# EAGLE schematic fpv-diversity (EAGLE 9.6.2)
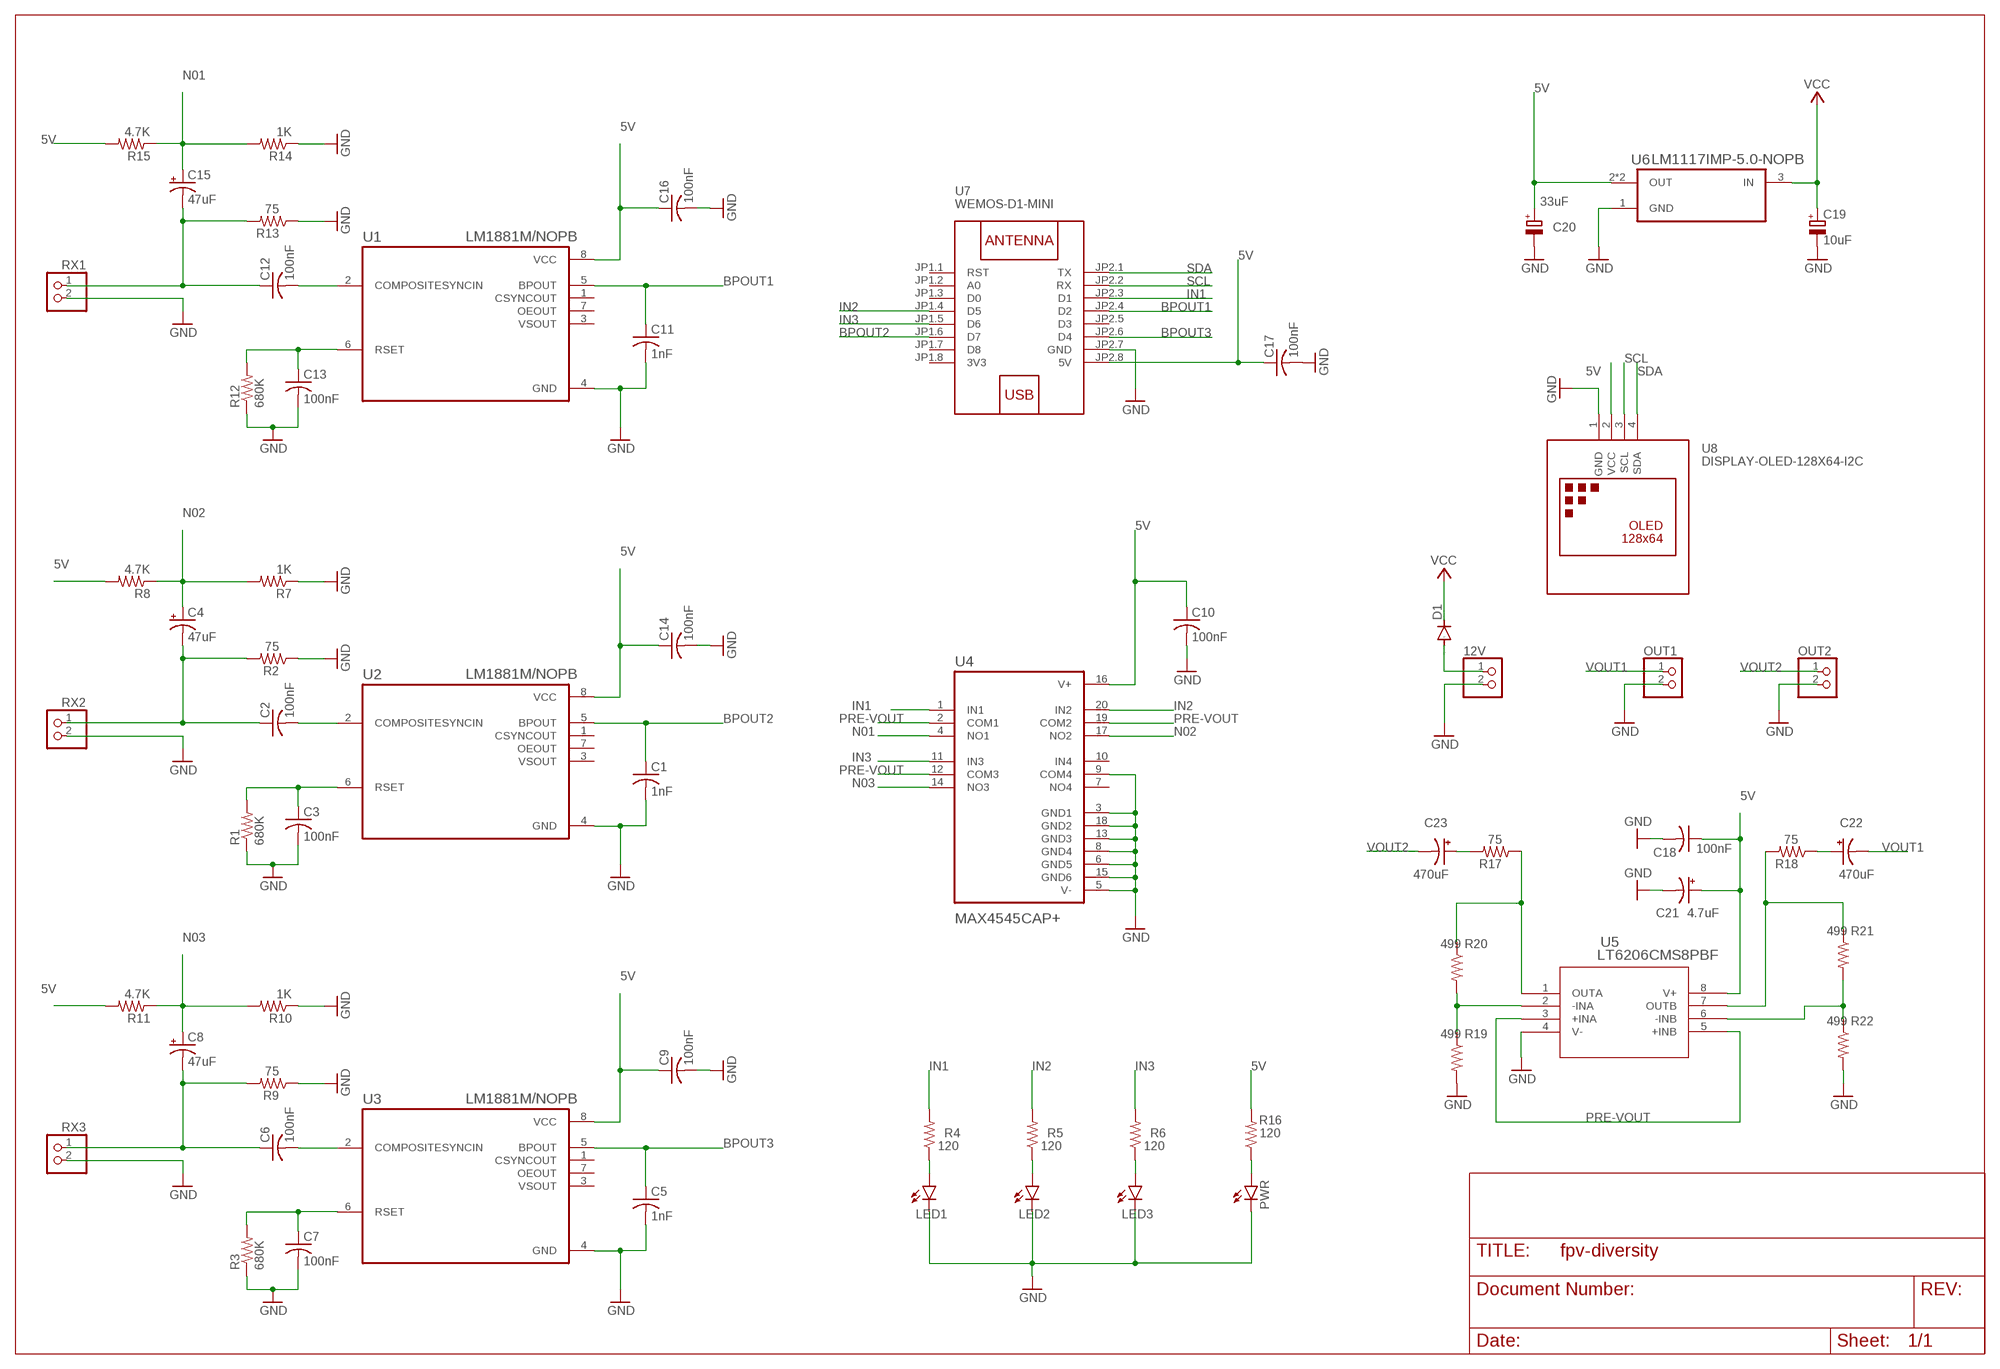
[diagram p0: schematic, sheet 1]

## Parts
12V  PINHD-1X2  [1X02]
C1  1nF  C-USC0603  [C0603]
C2  100nF  C-USC0805  [C0805]
C3  100nF  C-USC0805  [C0805]
C4  47uF  CPOL-USCT3216  [CT3216]
C5  1nF  C-USC0603  [C0603]
C6  100nF  C-USC0805  [C0805]
C7  100nF  C-USC0805  [C0805]
C8  47uF  CPOL-USCT3216  [CT3216]
C9  100nF  C-USC0805  [C0805]
C10  100nF  C-USC0805  [C0805]
C11  1nF  C-USC0603  [C0603]
C12  100nF  C-USC0805  [C0805]
C13  100nF  C-USC0805  [C0805]
C14  100nF  C-USC0805  [C0805]
C15  47uF  CPOL-USCT3216  [CT3216]
C16  100nF  C-USC0805  [C0805]
C17  100nF  C-USC0805  [C0805]
C18  100nF  C-USC0805  [C0805]
C19  10uF  CPOL-EUD/7343-31W  [D/7343-31W]
C20  33uF  CPOL-EUD/7343-31W  [D/7343-31W]
C21  4.7uF  CPOL-USCT3528  [CT3528]
C22  470uF  CPOL-USUD-6,3X7,7  [UD-6,3X7,7_NICHICON]
C23  470uF  CPOL-USUD-6,3X7,7  [UD-6,3X7,7_NICHICON]
D1  DIODE-DO-214AC  [DO-214AC]
LED1  LEDCHIPLED_0603  [CHIPLED_0603]
LED2  LEDCHIPLED_0603  [CHIPLED_0603]
LED3  LEDCHIPLED_0603  [CHIPLED_0603]
OUT1  PINHD-1X2  [1X02]
OUT2  PINHD-1X2  [1X02]
PWR  LEDCHIPLED_0603  [CHIPLED_0603]
R1  680K  R-US_R0805  [R0805]
R2  75  R-US_R0805  [R0805]
R3  680K  R-US_R0805  [R0805]
R4  120  R-US_R0603  [R0603]
R5  120  R-US_R0603  [R0603]
R6  120  R-US_R0603  [R0603]
R7  1K  R-US_R0805  [R0805]
R8  4.7K  R-US_R0805  [R0805]
R9  75  R-US_R0805  [R0805]
R10  1K  R-US_R0805  [R0805]
R11  4.7K  R-US_R0805  [R0805]
R12  680K  R-US_R0805  [R0805]
R13  75  R-US_R0805  [R0805]
R14  1K  R-US_R0805  [R0805]
R15  4.7K  R-US_R0805  [R0805]
R16  120  R-US_R0603  [R0603]
R17  75  R-US_R0805  [R0805]
R18  75  R-US_R0805  [R0805]
R19  499  R-US_R1206  [R1206]
R20  499  R-US_R1206  [R1206]
R21  499  R-US_R1206  [R1206]
R22  499  R-US_R1206  [R1206]
RX1  PINHD-1X2  [1X02]
RX2  PINHD-1X2  [1X02]
RX3  PINHD-1X2  [1X02]
U1  LM1881M/NOPB  [SOIC127P599X175-8N]
U2  LM1881M/NOPB  [SOIC127P599X175-8N]
U3  LM1881M/NOPB  [SOIC127P599X175-8N]
U4  MAX4545CAP+  [SOP65P777X199-20N]
U5  LT6206CMS8PBF  [MSOP-8_MS]
U6  LM1117IMP-5.0-NOPB  [SOT230P700X180-4N]
U7  WEMOS-D1-MINI  [WEMOS-D1-MINI]
U8  DISPLAY-OLED-128X64-I2C  [DISPLAY-OLED-128X64-I2C]

## Nets
5V: C9.1 C10.1 C14.1 C16.1 C17.1 C18.1 C20.+ C21.+ R8.2 R11.2 R15.2 R16.2 U1.8(VCC) U2.8(VCC) U3.8(VCC) U4.16(V+) U5.8(V+) U6.2(OUT) U6.4(OUT) U7.JP2.8(5V) U8.2(VCC)
BPOUT1: C11.1 U1.5(BPOUT) U7.JP2.4(D2)
BPOUT2: C1.1 U2.5(BPOUT) U7.JP1.6(D7)
BPOUT3: C5.1 U3.5(BPOUT) U7.JP2.6(D4)
GND: 12V.2 C1.2 C3.2 C5.2 C7.2 C9.2 C10.2 C11.2 C13.2 C14.2 C16.2 C17.2 C18.2 C19.- C20.- C21.- LED1.C LED2.C LED3.C OUT1.2 OUT2.2 PWR.C R1.1 R2.1 R3.1 R7.1 R9.1 R10.1 R12.1 R13.1 R14.1 R19.2 R22.2 RX1.2 RX2.2 RX3.2 U1.4(GND) U2.4(GND) U3.4(GND) U4.3(GND1) U4.5(V-) U4.6(GND5) U4.8(GND4) U4.9(COM4) U4.13(GND3) U4.15(GND6) U4.18(GND2) U5.4(V-) U6.1(GND) U7.JP2.7(GND) U8.1(GND)
IN1: R4.2 U4.1(IN1) U7.JP2.3(D1)
IN2: R5.2 U4.20(IN2) U7.JP1.4(D5)
IN3: R6.2 U4.11(IN3) U7.JP1.5(D6)
N01: C15.+ R14.2 R15.1 U4.4(NO1)
N02: C4.+ R7.2 R8.1 U4.17(NO2)
N03: C8.+ R10.2 R11.1 U4.14(NO3)
N$1: C7.1 R3.2 U3.6(RSET)
N$2: C3.1 R1.2 U2.6(RSET)
N$3: C2.2 U2.2(COMPOSITESYNCIN)
N$4: PWR.A R16.1
N$5: C6.2 U3.2(COMPOSITESYNCIN)
N$6: 12V.1 D1.A
N$7: LED1.A R4.1
N$8: LED2.A R5.1
N$9: LED3.A R6.1
N$10: C13.1 R12.2 U1.6(RSET)
N$11: C12.2 U1.2(COMPOSITESYNCIN)
N$12: R19.1 R20.2 U5.2(-INA)
N$13: R18.2 R21.1 U5.7(OUTB)
N$14: R21.2 R22.1 U5.6(-INB)
N$15: R17.1 R20.1 U5.1(OUTA)
N$16: C22.+ R18.1
N$17: C23.+ R17.2
PRE-VOUT: U4.2(COM1) U4.12(COM3) U4.19(COM2) U5.3(+INA) U5.5(+INB)
SCL: U7.JP2.2(RX) U8.3(SCL)
SDA: U7.JP2.1(TX) U8.4(SDA)
VCC: C19.+ D1.C U6.3(IN)
VID1: C12.1 C15.- R13.2 RX1.1
VID2: C2.1 C4.- R2.2 RX2.1
VID3: C6.1 C8.- R9.2 RX3.1
VOUT1: C22.- OUT1.1
VOUT2: C23.- OUT2.1
Unconnected: U1.1(CSYNCOUT) U1.3(VSOUT) U1.7(OEOUT) U2.1(CSYNCOUT) U2.3(VSOUT) U2.7(OEOUT) U3.1(CSYNCOUT) U3.3(VSOUT) U3.7(OEOUT) U4.7(NO4) U4.10(IN4) U7.JP1.1(RST) U7.JP1.2(A0) U7.JP1.3(D0) U7.JP1.7(D8) U7.JP2.5(D3)

## Power pins joined to a net without a drawn wire
3V3: U7.JP1.8(3V3)

## Library data of the parts
12V OUT1 OUT2 RX1-RX3 = pinhead:PINHD-1X2: PIN HEADER
C1-C3 C5-C7 C9-C14 C16-C18 = rcl:C-US: CAPACITOR, American symbol; SPICEPREFIX: C
C4 C8 C15 C21-C23 = rcl:CPOL-US: POLARIZED CAPACITOR, American symbol; SPICEPREFIX: C
C19 C20 = rcl:CPOL-EU: POLARIZED CAPACITOR, European symbol; SPICEPREFIX: C
D1 = diode:DIODE-: DIODE
LED1-LED3 PWR = led:LED: LED OSRAM: - CHIPLED LG R971, LG N971, LY N971, LG Q971, LY Q971, LO R971, LY R971 LH N974, LH R974 LS Q976, LO Q976, LY Q976 LO Q996 - Hyper CHIPLED LW Q18S LB Q993, LB Q99A, LB R99A - SideLED LS A670, LO A670, LY A670, LG A670, LP A670 LB A673, LV A673, LT A673, LW A673 LH A674 LY A675 LS A676, LA A676, LO A676, LY A676, LW A676 LS A679, LY A679, LG A679 - Hyper Micro SIDELED® LS Y876, LA Y876, LO Y876, LY Y876 LT Y87S - SmartLED LW L88C, LW L88S LB L89C, LB L89S, LG L890 LS L89K, LO L89K, LY L89K LS L896, LA L896, LO L896, LY L896 - TOPLED LS T670, LO T670, LY T670, LG T670, LP T670 LSG T670, LSP T670, LSY T670, LOP T670, LYG T670 LG T671, LOG T671, LSG T671 LB T673, LV T673, LT T673, LW T673 LH T674 LS T676, LA T676, LO T676, LY T676, LB T676, LH T676, LSB T676, LW T676 LB T67C, LV T67C, LT T67C, LS T67K, LO T67K, LY T67K, LW E67C LS E67B, LA E67B, LO E67B, LY E67B, LB E67C, LV E67C, LT E67C LW T67C LS T679, LY T679, LG T679 LS T770, LO T770, LY T770, LG T770, LP T770 LB T773, LV T773, LT T773, LW T773 LH T774 LS E675, LA E675, LY E675, LS T675 LS T776, LA T776, LO T776, LY T776, LB T776 LHGB T686 LT T68C, LB T68C - Hyper Mini TOPLED® LB M676 - Mini TOPLED Santana® LG M470 LS M47K, LO M47K, LY M47K Source: http://www.osram.convergy.de LUXEON: - LUMILED® LXK2-PW12-R00, LXK2-PW12-S00, LXK2-PW14-U00, LXK2-PW14-V00 LXK2-PM12-R00, LXK2-PM12-S00, LXK2-PM14-U00 LXK2-PE12-Q00, LXK2-PE12-R00, LXK2-PE12-S00, LXK2-PE14-T00, LXK2-PE14-U00 LXK2-PB12-K00, LXK2-PB12-L00, LXK2-PB12-M00, LXK2-PB14-N00, LXK2-PB14-P00, LXK2-PB14-Q00 LXK2-PR12-L00, LXK2-PR12-M00, LXK2-PR14-Q00, LXK2-PR14-R00 LXK2-PD12-Q00, LXK2-PD12-R00, LXK2-PD12-S00 LXK2-PH12-R00, LXK2-PH12-S00 LXK2-PL12-P00, LXK2-PL12-Q00, LXK2-PL12-R00 Source: www.luxeon.com KINGBRIGHT: KA-3528ASYC Source: www.kingbright.com
R1-R22 = rcl:R-US_: RESISTOR, American symbol; SPICEPREFIX: R
U1-U3 = LM1881M_NOPB:LM1881M/NOPB: Check prices <https://pricing.snapeda.com/parts/LM1881M/NOPB/Texas%20Instruments/view-part?ref=eda>; AVAILABILITY: Warning; DESCRIPTION: Video Sync Separator 8-SOIC 0 to 70; MF: Texas Instruments; MP: LM1881M/NOPB; PACKAGE: SOIC-8 Texas Instruments; PRICE: None; PURCHASE-URL: https://pricing.snapeda.com/search/part/LM1881M/NOPB/?ref=eda
U4 = MAX4545CAP_:MAX4545CAP+: None Check prices <https://pricing.snapeda.com/parts/MAX4545CAP%2B/Maxim%20Integrated/view-part?ref=eda>; AVAILABILITY: Warning; DESCRIPTION: Video Switch IC 4 Channel 20-SSOP; MF: Maxim Integrated; MP: MAX4545CAP+; PACKAGE: SSOP-20 Maxim; PRICE: None; PURCHASE-URL: https://pricing.snapeda.com/search/part/MAX4545CAP+/?ref=eda
U5 = LT6206CMS8PBF:LT6206CMS8PBF: Check prices <https://pricing.snapeda.com/parts/LT6206CMS8%23PBF/Analog%20Devices/view-part?ref=eda>; AVAILABILITY: Good; DESCRIPTION: Video Amp, 2 Voltage Feedback 8-MSOP; MF: Analog Devices; MP: LT6206CMS8#PBF; PACKAGE: MSOP-8 Analog Devices; PRICE: None
U6 = LM1117IMP-5.0-NOPB:LM1117IMP-5.0-NOPB: Check prices <https://pricing.snapeda.com/parts/LM1117IMP-5.0/NOPB/Texas%20Instruments/view-part?ref=eda>; AVAILABILITY: Good; DESCRIPTION: 800-mA 15-V linear voltage regulator 4-SOT-223 -40 to 125; MF: Texas Instruments; MP: LM1117IMP-5.0/NOPB; PACKAGE: SOT-223-4 Texas Instruments; PRICE: None; PURCHASE-URL: https://pricing.snapeda.com/search/part/LM1117IMP-5.0/NOPB/?ref=eda
U7 = diy-modules:WEMOS-D1-MINI: WEMOS D1 mini: Mini Wi-Fi Board based on ESP-8266 device More details can be found here: https://www.wemos.cc/product/d1-mini.html Click here to find device on ebay.com <http://www.ebay.com/sch/wemos+d1+mini+nodemcu>
U8 = DISPLAY-OLED-128X64-I2C-3D:DISPLAY-OLED-128X64-I2C: 128x64 Dot Matrix OLED Module based on SSD1306 chip Variant with I2C interface More details available here: http://www.instructables.com/id/Monochrome-096-i2c-OLED-display-with-arduino-SSD13/ SSD1306 datasheet: https://cdn-shop.adafruit.com/datasheets/SSD1306.pdf Click here to find device on ebay.com <http://www.ebay.com/sch/oled+display+128x64+iic> Note: There are two variants: I2C and SPI. Search for the proper version.